# Altium schematic sheet Relay_channel.SchDoc: Switch Matrix 32:2
size 420 x 297 mm; Author: G.Kasprowicz; CompanyName: WUT ISE; DrawnBy: G.Kasprowicz; Organization: WUT ISE; Address1: PW ISE; Address2: Nowowiejska 15/19 00-665 Warsaw; Address3: gkasprow@gmail.com; DocumentNumber: 2; Revision: 2; SheetNumber: 2; SheetTotal: 6; ModifiedBy: -; CheckedDate: -; Title2: Relay channel; DivGrp: WUT ISE; Designer: G.Kasprowicz; ModifiedDate: -; ProjectName: Sensor Box
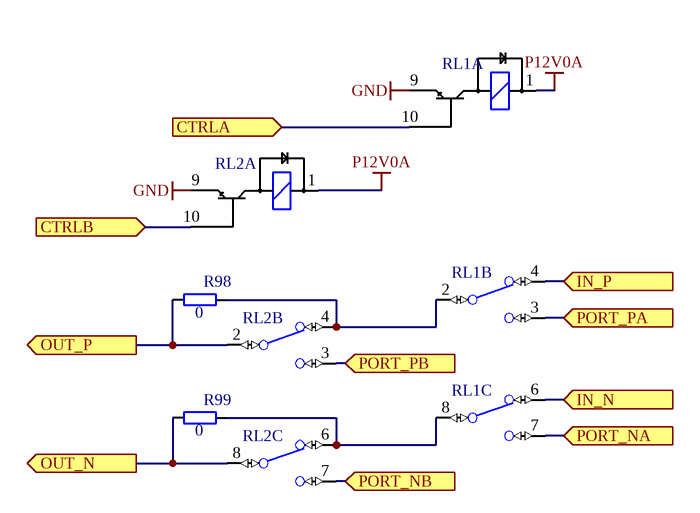
[diagram p0: Relay_channel.SchDoc]

## Parts
R98  0  [RESC1608X55N]
R99  0  [RESC1608X55N]
RL1  TELEDYNE_712TN  [REL_TELEDYNE_712TN]  (value not drawn)  (parts A,B,C of 3)
RL2  TELEDYNE_712TN  [REL_TELEDYNE_712TN]  (value not drawn)  (parts A,B,C of 3)

## Ports
CTRLA (in), CTRLB (in), IN_N (in), IN_P (in), OUT_N (out), OUT_P (out), PORT_NA (in), PORT_NB (in), PORT_PA (in), PORT_PB (in)

## Nets
GND: RL1.9 RL2.9
P12V0A: RL1.1 RL2.1
CTRLA: RL1.10 ; port CTRLA
CTRLB: RL2.10 ; port CTRLB
IN_N: RL1.6(NC) ; port IN_N
IN_P: RL1.4(NC) ; port IN_P
OUT_N: R99.1 RL2.8(C) ; port OUT_N
OUT_P: R98.1 RL2.2(C) ; port OUT_P
PORT_NA: RL1.7(NO) ; port PORT_NA
PORT_NB: RL2.7(NO) ; port PORT_NB
PORT_PA: RL1.3(NO) ; port PORT_PA
PORT_PB: RL2.3(NO) ; port PORT_PB
NetR98_2: R98.2 RL1.2(C) RL2.4(NC)
NetR99_2: R99.2 RL1.8(C) RL2.6(NC)

## Notes on the sheet
- Project/Equipment
- Document
- Designer
- Drawn by
- Check.by
- Copyright WUT ISE 2020.
  This documentation describes Open Hardware and is licensed under the CERN OHL v.1.2. You may redistribute and modify this documentation under the terms of the CERN OHL v.1.2. (http://ohwr.org/CERNOHL). This documentation is distributed WITHOUT ANY EXPRESS OR IMPLIED WARRANTY, INCLUDING OF MERCHANTABILITY, SATISFACTORY QUALITY AND FITNESS FOR A PARTICULAR PURPOSE. Please see the CERN OHL v.1.2 for applicable conditions.
- Contact
- File
- Last Mod.
- Print Date
- Sheet
- Size
- A3
- of
- Rev

## Library data of the parts
R98 R99 = R0603_0R_JUMPER: Resistor; Part Description: 1A (0.05R Max DC Resistance) Zero Ohm Jumper; Manufacturer: GENERIC; Manufacturer1 Part Number: NRC06Z0; PressFit: No; Part Number: R0603_0R_JUMPER; Component Kind: Standard; Component Type: Standard; Pin Count: 2; Value: 0; Status: Preferred; Manufacturer Part Number: R0603_0R_JUMPER; Case: 0603; Mounted: Yes; Sense: No; Socket: No; SMD: Yes; Manufacturer1 Example: NIC COMPONENT; Manufacturer1 ComponentHeight: 0.55mm; HelpURL: \\cern.ch\dfs\Applications\Altium\Datasheets\R0603_NIC_NRC.pdf; Author: CERN DEM JLC; CreateDate: 03.12.2007; LatestRevisionDate: 13.03.2008
RL1 RL2 = REL_TELEDYNE_712TN-12: DPDT Non-latching Commercial Sensitive Basic Relay; Part Number: REL_TELEDYNE__712TN-12; PressFit: No; Value: 12VDC; Component Kind: Standard; Component Type: Standard; Footprint: REL_TELEDYNE__712TN; Pin Count: 8; PackageDescription: TELEDYNE Case TO-5, 8 Leads, Body Diameter 9.4m, x Height 9.76mm, 732 Series; Mounted: Yes; Socket: No; SMD: No; Sense: No; Status: None; Part Description: DPDT Non-latching Commercial Sensitive Basic Relay; Manufacturer: TELEDYNE; Manufacturer Part Number: 712TN-12; ComponentHeight: 9.76mm; HelpURL: \\cern.ch\dfs\Applications\Altium\Datasheets\REL_TELEDYNE_732.pdf; Author: GK; CreateDate: 30.10.2013; LatestRevisionDate: 18.09.2014